# EAGLE schematic digitalLatchShield (EAGLE 7.3.0)
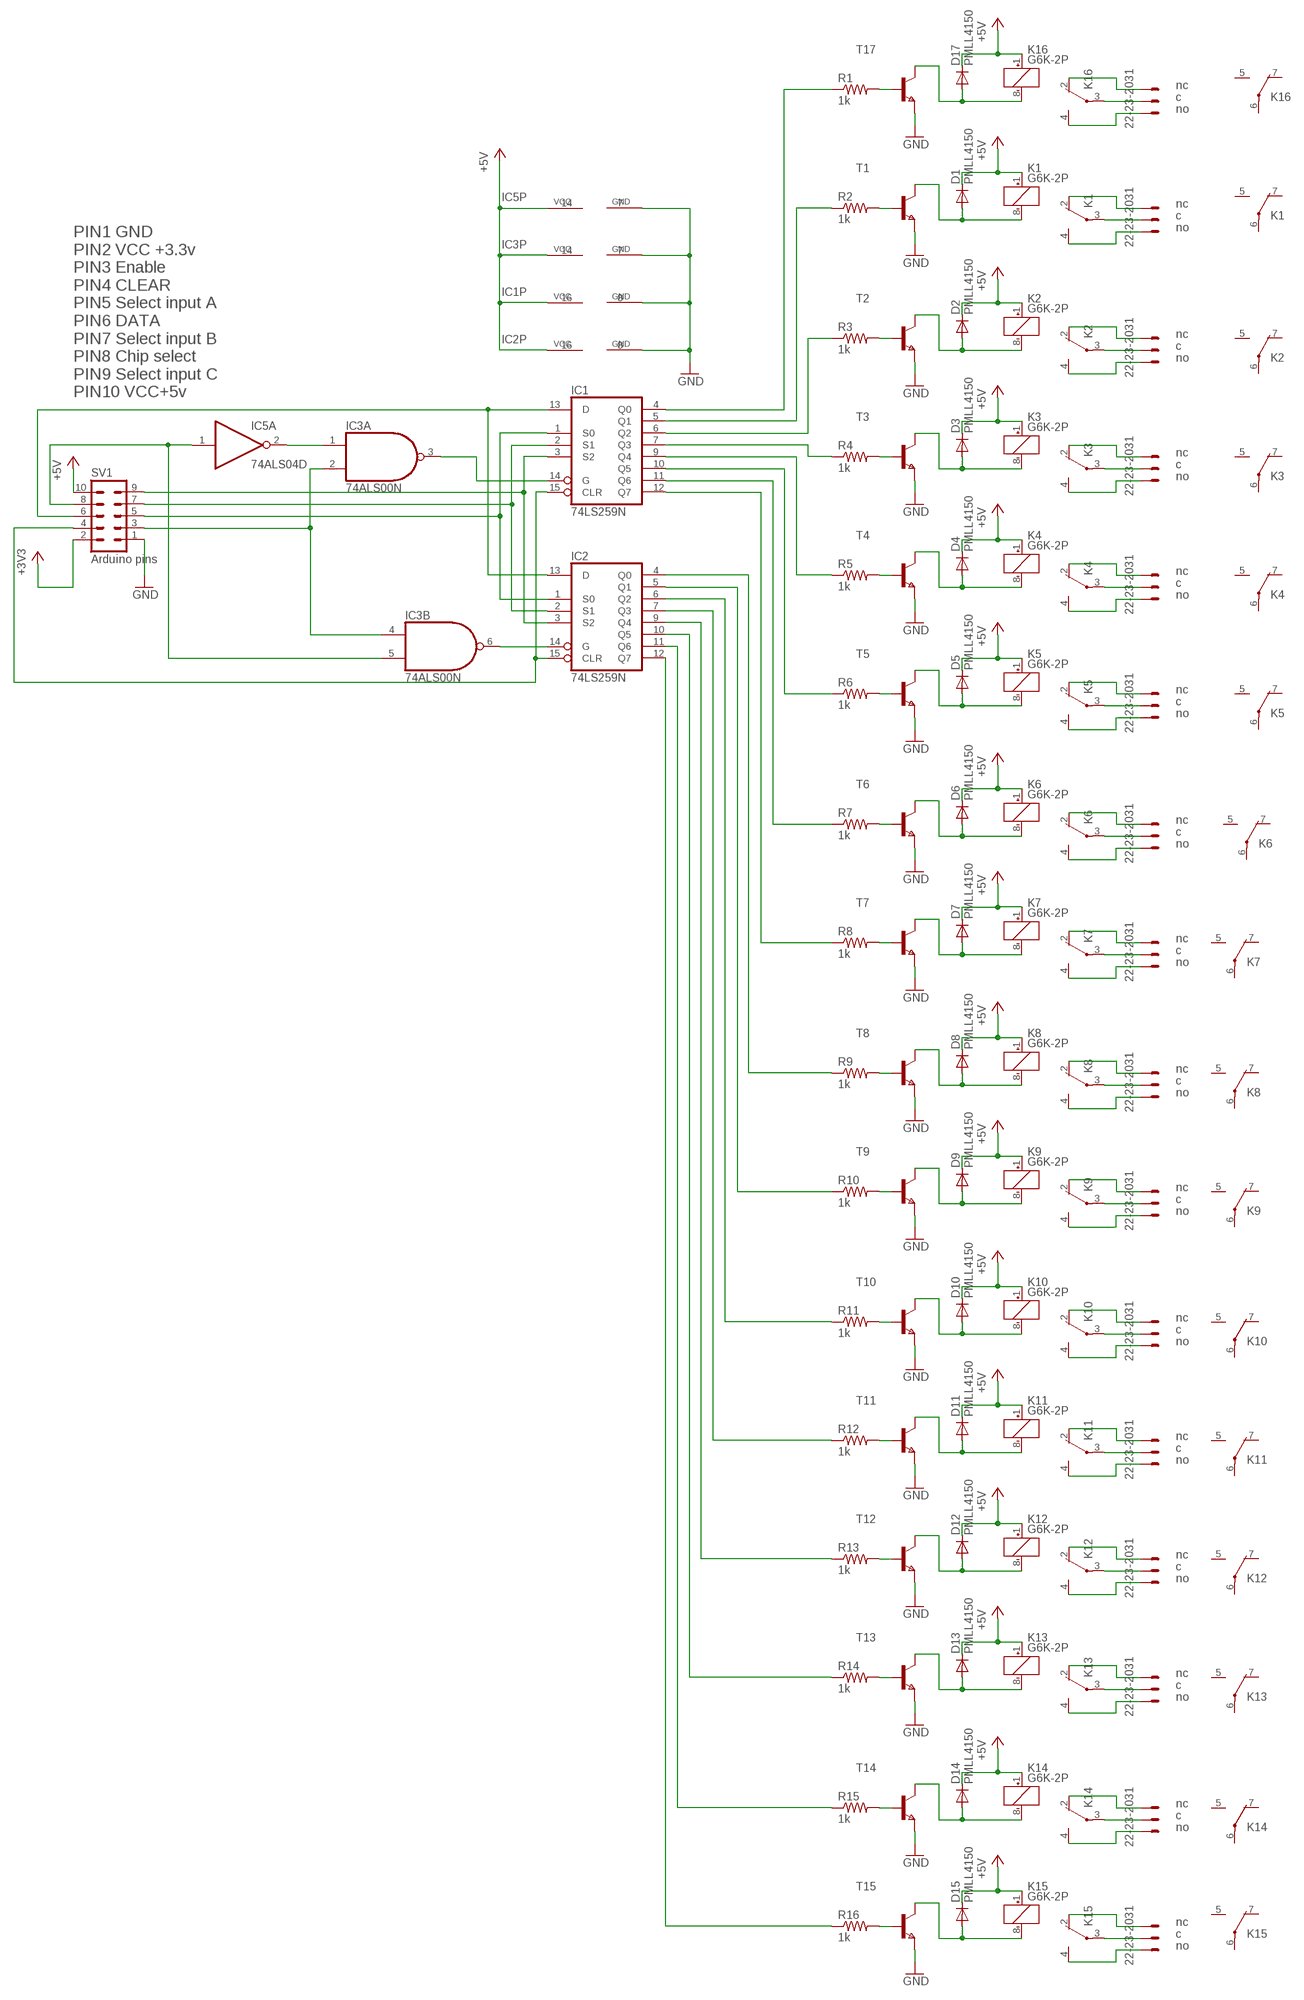
[diagram p0: schematic, sheet 1]

## Parts
D1  PMLL4150  [SOD80C]
D2  PMLL4150  [SOD80C]
D3  PMLL4150  [SOD80C]
D4  PMLL4150  [SOD80C]
D5  PMLL4150  [SOD80C]
D6  PMLL4150  [SOD80C]
D7  PMLL4150  [SOD80C]
D8  PMLL4150  [SOD80C]
D9  PMLL4150  [SOD80C]
D10  PMLL4150  [SOD80C]
D11  PMLL4150  [SOD80C]
D12  PMLL4150  [SOD80C]
D13  PMLL4150  [SOD80C]
D14  PMLL4150  [SOD80C]
D15  PMLL4150  [SOD80C]
D17  PMLL4150  [SOD80C]
IC1  74LS259N  [DIL16]
IC2  74LS259N  [DIL16]
IC3  74ALS00N  [DIL14]
IC5  74ALS04D  [SO14]
K1  G6K-2P  [G6K-2P]
K2  G6K-2P  [G6K-2P]
K3  G6K-2P  [G6K-2P]
K4  G6K-2P  [G6K-2P]
K5  G6K-2P  [G6K-2P]
K6  G6K-2P  [G6K-2P]
K7  G6K-2P  [G6K-2P]
K8  G6K-2P  [G6K-2P]
K9  G6K-2P  [G6K-2P]
K10  G6K-2P  [G6K-2P]
K11  G6K-2P  [G6K-2P]
K12  G6K-2P  [G6K-2P]
K13  G6K-2P  [G6K-2P]
K14  G6K-2P  [G6K-2P]
K15  G6K-2P  [G6K-2P]
K16  G6K-2P  [G6K-2P]
R1  1k  R-US_M0805  [M0805]
R2  1k  R-US_M0805  [M0805]
R3  1k  R-US_M0805  [M0805]
R4  1k  R-US_M0805  [M0805]
R5  1k  R-US_M0805  [M0805]
R6  1k  R-US_M0805  [M0805]
R7  1k  R-US_M0805  [M0805]
R8  1k  R-US_M0805  [M0805]
R9  1k  R-US_M0805  [M0805]
R10  1k  R-US_M0805  [M0805]
R11  1k  R-US_M0805  [M0805]
R12  1k  R-US_M0805  [M0805]
R13  1k  R-US_M0805  [M0805]
R14  1k  R-US_M0805  [M0805]
R15  1k  R-US_M0805  [M0805]
R16  1k  R-US_M0805  [M0805]
SV1  Arduino pins  MA05-2  [MA05-2]
T1  NPNSOT23  [SOT-23]
T2  NPNSOT23  [SOT-23]
T3  NPNSOT23  [SOT-23]
T4  NPNSOT23  [SOT-23]
T5  NPNSOT23  [SOT-23]
T6  NPNSOT23  [SOT-23]
T7  NPNSOT23  [SOT-23]
T8  NPNSOT23  [SOT-23]
T9  NPNSOT23  [SOT-23]
T10  NPNSOT23  [SOT-23]
T11  NPNSOT23  [SOT-23]
T12  NPNSOT23  [SOT-23]
T13  NPNSOT23  [SOT-23]
T14  NPNSOT23  [SOT-23]
T15  NPNSOT23  [SOT-23]
T17  NPNSOT23  [SOT-23]
X1  22-23-2031  [22-23-2031]
X2  22-23-2031  [22-23-2031]
X3  22-23-2031  [22-23-2031]
X4  22-23-2031  [22-23-2031]
X5  22-23-2031  [22-23-2031]
X6  22-23-2031  [22-23-2031]
X7  22-23-2031  [22-23-2031]
X8  22-23-2031  [22-23-2031]
X9  22-23-2031  [22-23-2031]
X10  22-23-2031  [22-23-2031]
X11  22-23-2031  [22-23-2031]
X12  22-23-2031  [22-23-2031]
X13  22-23-2031  [22-23-2031]
X14  22-23-2031  [22-23-2031]
X15  22-23-2031  [22-23-2031]
X16  22-23-2031  [22-23-2031]

## Nets
+3V3: SV1.2
+5V: D1.C D2.C D3.C D4.C D5.C D6.C D7.C D8.C D9.C D10.C D11.C D12.C D13.C D14.C D15.C D17.C IC1.16(VCC) IC2.16(VCC) IC3.14(P:VCC) IC5.14(P:VCC) K1.1(1:+) K2.1(1:+) K3.1(1:+) K4.1(1:+) K5.1(1:+) K6.1(1:+) K7.1(1:+) K8.1(1:+) K9.1(1:+) K10.1(1:+) K11.1(1:+) K12.1(1:+) K13.1(1:+) K14.1(1:+) K15.1(1:+) K16.1(1:+) SV1.10
GND: IC1.8(GND) IC2.8(GND) IC3.7(P:GND) IC5.7(P:GND) SV1.1 T1.2(E) T2.2(E) T3.2(E) T4.2(E) T5.2(E) T6.2(E) T7.2(E) T8.2(E) T9.2(E) T10.2(E) T11.2(E) T12.2(E) T13.2(E) T14.2(E) T15.2(E) T17.2(E)
N$1: IC1.14(G) IC3.3(A:O)
N$2: IC2.14(G) IC3.6(B:O)
N$3: IC1.3(S2) IC2.3(S2) SV1.9
N$4: IC1.2(S1) IC2.2(S1) SV1.7
N$5: IC1.1(S0) IC2.1(S0) SV1.5
N$6: R1.2 T17.3(B)
N$7: K16.3(2:P) X1.2
N$8: D17.A K16.8(1:-) T17.1(C)
N$9: K16.2(2:O) X1.1
N$10: K16.4(2:S) X1.3
N$11: R2.2 T1.3(B)
N$12: D1.A K1.8(1:-) T1.1(C)
N$13: K1.3(2:P) X2.2
N$14: K1.2(2:O) X2.1
N$15: K1.4(2:S) X2.3
N$16: R3.2 T2.3(B)
N$17: D2.A K2.8(1:-) T2.1(C)
N$18: K2.3(2:P) X3.2
N$19: K2.2(2:O) X3.1
N$20: K2.4(2:S) X3.3
N$21: R4.2 T3.3(B)
N$22: D3.A K3.8(1:-) T3.1(C)
N$23: K3.3(2:P) X4.2
N$24: K3.2(2:O) X4.1
N$25: K3.4(2:S) X4.3
N$26: R5.2 T4.3(B)
N$27: D4.A K4.8(1:-) T4.1(C)
N$28: K4.3(2:P) X5.2
N$29: K4.2(2:O) X5.1
N$30: K4.4(2:S) X5.3
N$31: R6.2 T5.3(B)
N$32: D5.A K5.8(1:-) T5.1(C)
N$33: K5.3(2:P) X6.2
N$34: K5.2(2:O) X6.1
N$35: K5.4(2:S) X6.3
N$36: R7.2 T6.3(B)
N$37: D6.A K6.8(1:-) T6.1(C)
N$38: K6.3(2:P) X7.2
N$39: K6.2(2:O) X7.1
N$40: K6.4(2:S) X7.3
N$41: R8.2 T7.3(B)
N$42: D7.A K7.8(1:-) T7.1(C)
N$43: K7.3(2:P) X8.2
N$44: K7.2(2:O) X8.1
N$45: K7.4(2:S) X8.3
N$46: R9.2 T8.3(B)
N$47: D8.A K8.8(1:-) T8.1(C)
N$48: K8.3(2:P) X9.2
N$49: K8.2(2:O) X9.1
N$50: K8.4(2:S) X9.3
N$51: R10.2 T9.3(B)
N$52: D9.A K9.8(1:-) T9.1(C)
N$53: K9.3(2:P) X10.2
N$54: K9.2(2:O) X10.1
N$55: K9.4(2:S) X10.3
N$56: R11.2 T10.3(B)
N$57: D10.A K10.8(1:-) T10.1(C)
N$58: K10.3(2:P) X11.2
N$59: K10.2(2:O) X11.1
N$60: K10.4(2:S) X11.3
N$61: R12.2 T11.3(B)
N$62: D11.A K11.8(1:-) T11.1(C)
N$63: K11.3(2:P) X12.2
N$64: K11.2(2:O) X12.1
N$65: K11.4(2:S) X12.3
N$66: R13.2 T12.3(B)
N$67: D12.A K12.8(1:-) T12.1(C)
N$68: K12.3(2:P) X13.2
N$69: K12.2(2:O) X13.1
N$70: K12.4(2:S) X13.3
N$71: R14.2 T13.3(B)
N$72: D13.A K13.8(1:-) T13.1(C)
N$73: K13.3(2:P) X14.2
N$74: K13.2(2:O) X14.1
N$75: K13.4(2:S) X14.3
N$76: R15.2 T14.3(B)
N$77: D14.A K14.8(1:-) T14.1(C)
N$78: K14.3(2:P) X15.2
N$79: K14.2(2:O) X15.1
N$80: K14.4(2:S) X15.3
N$81: R16.2 T15.3(B)
N$82: D15.A K15.8(1:-) T15.1(C)
N$83: K15.3(2:P) X16.2
N$84: K15.2(2:O) X16.1
N$85: K15.4(2:S) X16.3
N$86: IC1.4(Q0) R1.1
N$87: IC1.5(Q1) R2.1
N$88: IC1.6(Q2) R3.1
N$89: IC1.7(Q3) R4.1
N$90: IC1.9(Q4) R5.1
N$91: IC1.10(Q5) R6.1
N$92: IC1.11(Q6) R7.1
N$93: IC1.12(Q7) R8.1
N$94: IC2.4(Q0) R9.1
N$95: IC2.5(Q1) R10.1
N$96: IC2.6(Q2) R11.1
N$97: IC2.7(Q3) R12.1
N$98: IC2.9(Q4) R13.1
N$99: IC2.10(Q5) R14.1
N$100: IC2.11(Q6) R15.1
N$101: IC2.12(Q7) R16.1
N$102: IC1.15(CLR) IC2.15(CLR) SV1.4
N$103: IC3.2(A:I1) IC3.4(B:I0) SV1.3
N$105: IC3.5(B:I1) IC5.1(A:I) SV1.8
N$106: IC3.1(A:I0) IC5.2(A:O)
N$107: IC1.13(D) IC2.13(D) SV1.6
Unconnected: IC3.8(C:O) IC3.9(C:I0) IC3.10(C:I1) IC3.11(D:O) IC3.12(D:I0) IC3.13(D:I1) IC5.3(B:I) IC5.4(B:O) IC5.5(C:I) IC5.6(C:O) IC5.8(D:O) IC5.9(D:I) IC5.10(E:O) IC5.11(E:I) IC5.12(F:O) IC5.13(F:I) K1.5(3:S) K1.6(3:P) K1.7(3:O) K2.5(3:S) K2.6(3:P) K2.7(3:O) K3.5(3:S) K3.6(3:P) K3.7(3:O) K4.5(3:S) K4.6(3:P) K4.7(3:O) K5.5(3:S) K5.6(3:P) K5.7(3:O) K6.5(3:S) K6.6(3:P) K6.7(3:O) K7.5(3:S) K7.6(3:P) K7.7(3:O) K8.5(3:S) K8.6(3:P) K8.7(3:O) K9.5(3:S) K9.6(3:P) K9.7(3:O) K10.5(3:S) K10.6(3:P) K10.7(3:O) K11.5(3:S) K11.6(3:P) K11.7(3:O) K12.5(3:S) K12.6(3:P) K12.7(3:O) K13.5(3:S) K13.6(3:P) K13.7(3:O) K14.5(3:S) K14.6(3:P) K14.7(3:O) K15.5(3:S) K15.6(3:P) K15.7(3:O) K16.5(3:S) K16.6(3:P) K16.7(3:O)

## Notes on the sheet
- nc
- c
- no
- nc
- c
- no
- nc
- c
- no
- PIN1 GND
  PIN2 VCC +3.3v
  PIN3 Enable
  PIN4 CLEAR
  PIN5 Select input A
  PIN6 DATA
  PIN7 Select input B
  PIN8 Chip select
  PIN9 Select input C
  PIN10 VCC+5v
- nc
- c
- no
- nc
- c
- no
- nc
- c
- no
- nc
- c
- no
- nc
- c
- no
- nc
- c
- no
- nc
- c
- no
- nc
- c
- no
- nc
- c
- no
- nc
- c
- no
- nc
- c
- no
- nc
- c
- no
- nc
- c
- no

## Library data of the parts
D1-D15 D17 = diode:PMLL4150: DIODE high speed
IC1 IC2 = 74xx-us:74*259: 8-bit addressable LATCH
IC3 = 74xx-us:74*00: Quad 2-input NAND gate
IC5 = 74xx-us:74*04: Hex INVERTER
K1-K16 = relay:G6K: Low Signal Relay oeiwcsnts1.omron.com/.. D20G6K0100.pdf; MF: OMRON COMPONENTS USA; MPN: G6K-2P DC3; OC_FARNELL: 3937276; OC_NEWARK: 89C6482
R1-R16 = rcl:R-US_: RESISTOR, American symbol
SV1 = con-lstb:MA05-2: PIN HEADER; OC_FARNELL: unknown; OC_NEWARK: unknown
T1-T15 T17 = zetex:NPNSOT23: NPN TRANSISTOR; MPN: DSS20201L-7; OC_FARNELL: 1710688; OC_NEWARK: 25R4555
X1-X16 = con-molex:22-23-2031: .100" (2.54mm) Center Header - 3 Pin; MF: MOLEX; MPN: 22-23-2031; OC_FARNELL: 1462950; OC_NEWARK: 30C0862